# EAGLE schematic LED Cube 5x5x5 (EAGLE 8.3.1)
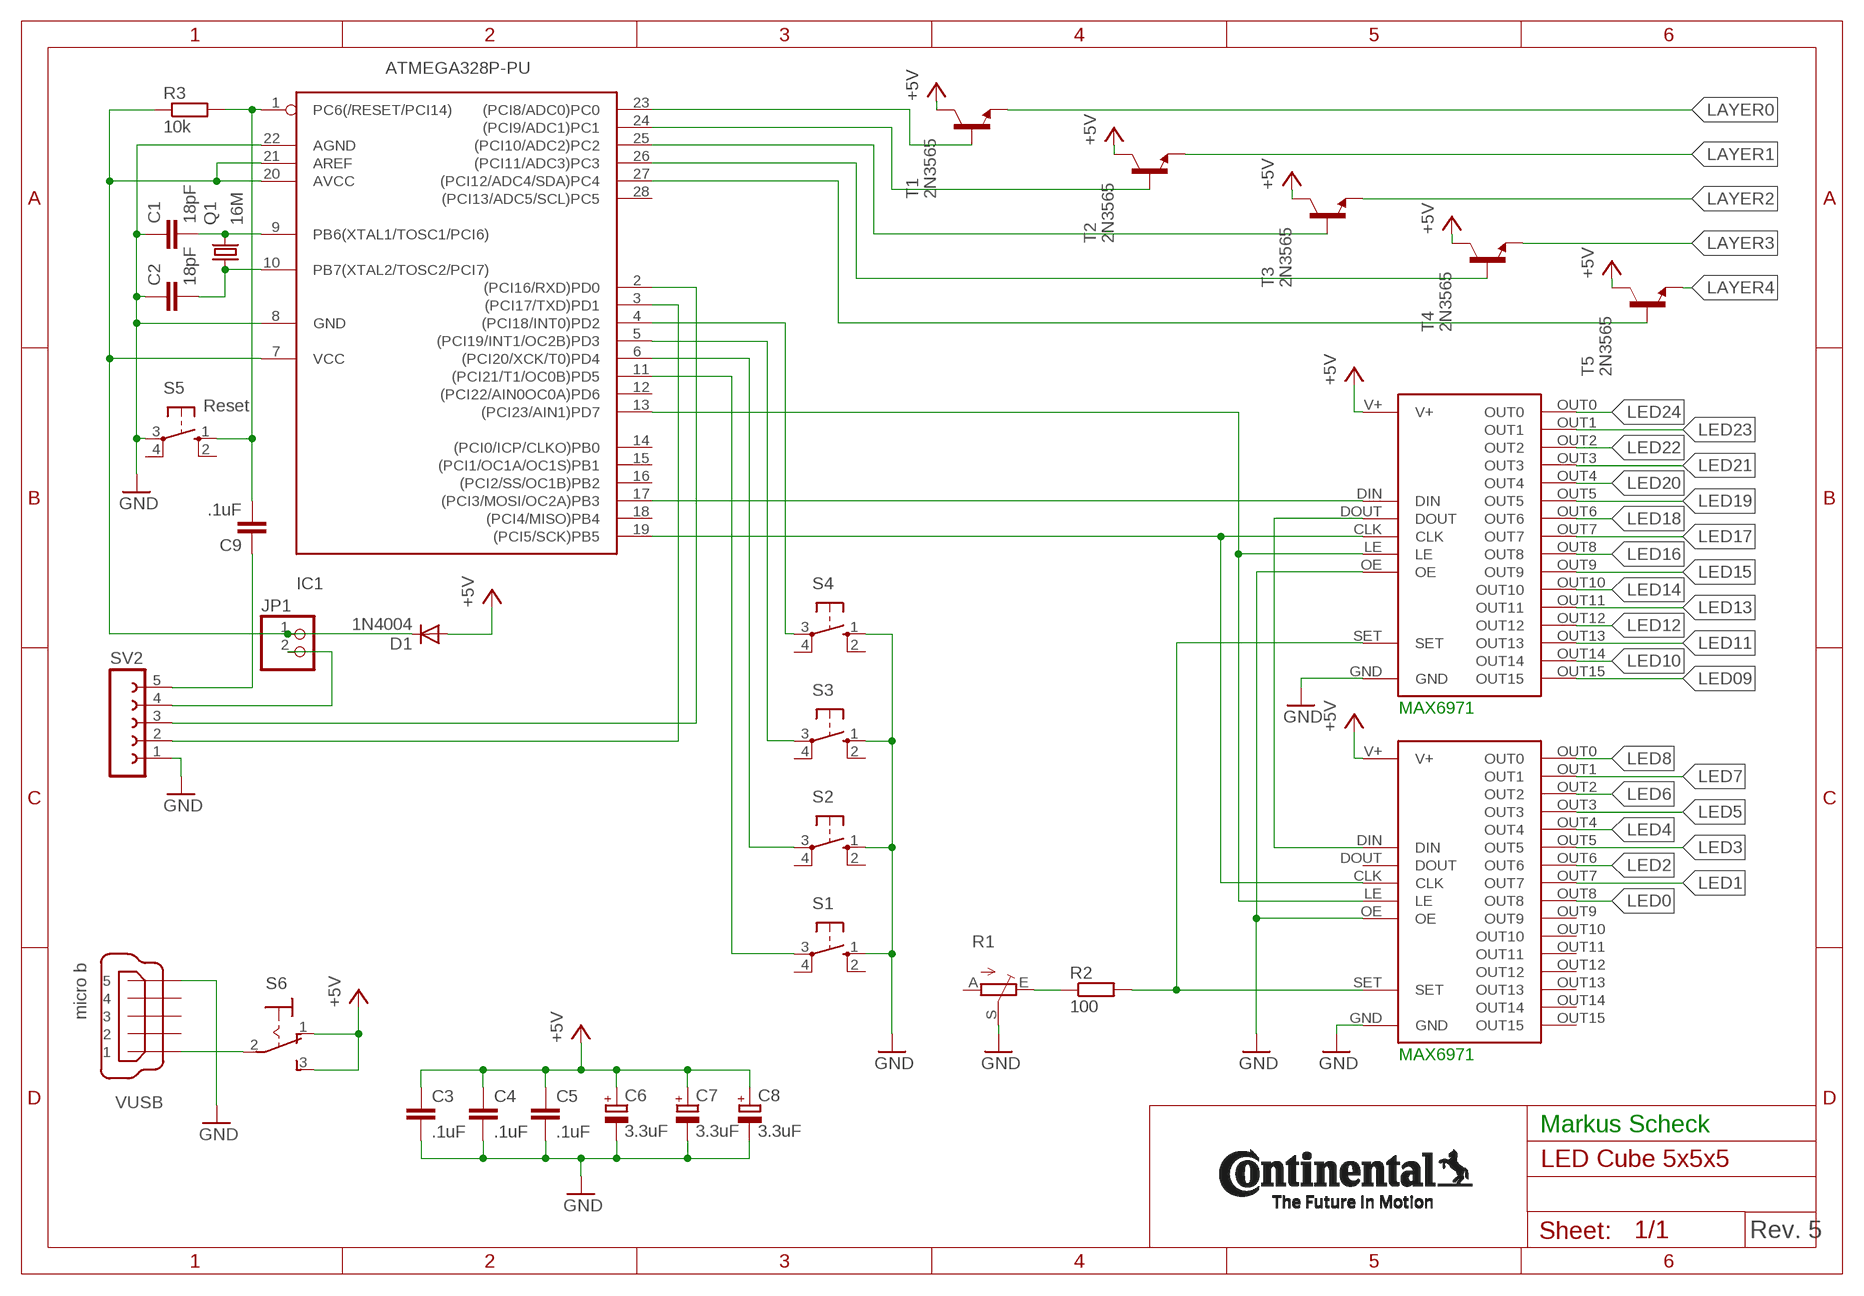
[diagram p0: schematic, sheet 1]

## Parts
C1  18pF  C2,5-3  [C2.5-3]
C2  18pF  C2,5-3  [C2.5-3]
C3  .1uF  C2,5-3  [C2.5-3]
C4  .1uF  C2,5-3  [C2.5-3]
C5  .1uF  C2,5-3  [C2.5-3]
C6  3.3uF  CPOL-EUB45181A  [B45181A]
C7  3.3uF  CPOL-EUB45181A  [B45181A]
C8  3.3uF  CPOL-EUB45181A  [B45181A]
C9  .1uF  C2.5/2  [C2.5-2]
D1  1N4004  [DO41-10]
IC1  ATMEGA328P-PU  ATMEGA328V-10P  [DIL28-3]
JP1  PINHD-1X2  [1X02]
Q1  16M  KX-KS  [11.4X4.5]
R1  TRIM_EU-CA6V  [CA6V]
R2  100  R-EU_0204/7  [0204/7]
R3  10k  R0204/7  [0204/7]
S1  10-XX  [B3F-10XX]
S2  10-XX  [B3F-10XX]
S3  10-XX  [B3F-10XX]
S4  10-XX  [B3F-10XX]
S5  Reset  10-XX  [B3F-10XX]
S6  320-916  [320-916]
SV2  FE05-1  [FE05-1]
T1  2N3565  [TO92]
T2  2N3565  [TO92]
T3  2N3565  [TO92]
T4  2N3565  [TO92]
T5  2N3565  [TO92]
U$1  MAX6971  [MAX6971]
U$2  MAX6971  [MAX6971]
VUSB  micro b  MINI-USB-32005-201  [32005-201]

## Nets
GND: C1.1 C2.1 C3.2 C4.2 C5.2 C6.- C7.- C8.- IC1.8(GND) IC1.22(AGND) R1.S S1.1(S) S2.1(S) S3.1(S) S4.1(S) S5.3(P) SV2.1 U$1.GND U$1.OE U$2.GND U$2.OE VUSB.5
LAYER0: T1.3(E)
LAYER1: T2.3(E)
LAYER2: T3.3(E)
LAYER3: T4.3(E)
LAYER4: T5.3(E)
LED0: U$1.OUT8
LED1: U$1.OUT7
LED2: U$1.OUT6
LED3: U$1.OUT5
LED4: U$1.OUT4
LED5: U$1.OUT3
LED6: U$1.OUT2
LED7: U$1.OUT1
LED8: U$1.OUT0
LED09: U$2.OUT15
LED10: U$2.OUT14
LED11: U$2.OUT13
LED12: U$2.OUT12
LED13: U$2.OUT11
LED14: U$2.OUT10
LED15: U$2.OUT9
LED16: U$2.OUT8
LED17: U$2.OUT7
LED18: U$2.OUT6
LED19: U$2.OUT5
LED20: U$2.OUT4
LED21: U$2.OUT3
LED22: U$2.OUT2
LED23: U$2.OUT1
LED24: U$2.OUT0
N$1: IC1.19((PCI5/SCK)PB5) U$1.CLK U$2.CLK
N$2: U$1.DIN U$2.DOUT
N$3: IC1.17((PCI3/MOSI/OC2A)PB3) U$2.DIN
N$4: IC1.13((PCI23/AIN1)PD7) U$1.LE U$2.LE
N$5: R1.E R2.1
N$7: R2.2 U$1.SET U$2.SET
N$9: IC1.6((PCI20/XCK/T0)PD4) S2.3(P)
N$10: IC1.11((PCI21/T1/OC0B)PD5) S1.3(P)
N$11: IC1.5((PCI19/INT1/OC2B)PD3) S3.3(P)
N$12: IC1.4((PCI18/INT0)PD2) S4.3(P)
N$13: C2.2 IC1.10(PB7(XTAL2/TOSC2/PCI7)) Q1.1
N$14: C1.2 IC1.9(PB6(XTAL1/TOSC1/PCI6)) Q1.2
N$15: IC1.3((PCI17/TXD)PD1) SV2.2
N$16: C9.2 IC1.1(PC6(/RESET/PCI14)) R3.2 S5.1(S)
N$17: IC1.2((PCI16/RXD)PD0) SV2.3
N$18: D1.C IC1.7(VCC) IC1.20(AVCC) IC1.21(AREF) JP1.1 R3.1
N$19: IC1.23((PCI8/ADC0)PC0) T1.2(B)
N$20: S6.2(P) VUSB.1
N$21: IC1.25((PCI10/ADC2)PC2) T3.2(B)
N$22: IC1.26((PCI11/ADC3)PC3) T4.2(B)
N$23: IC1.27((PCI12/ADC4/SDA)PC4) T5.2(B)
N$24: JP1.2 SV2.4
N$25: C9.1 SV2.5
N$29: IC1.24((PCI9/ADC1)PC1) T2.2(B)
VCC: C3.1 C4.1 C5.1 C6.+ C7.+ C8.+ D1.A S6.1(O) S6.3(S) T1.1(C) T2.1(C) T3.1(C) T4.1(C) T5.1(C) U$1.V+ U$2.V+ ; supply symbol labelled +5V
Unconnected: IC1.12((PCI22/AIN0OC0A)PD6) IC1.14((PCI0/ICP/CLKO)PB0) IC1.15((PCI1/OC1A/OC1S)PB1) IC1.16((PCI2/SS/OC1B)PB2) IC1.18((PCI4/MISO)PB4) IC1.28((PCI13/ADC5/SCL)PC5) R1.A S1.2(S1) S1.4(P1) S2.2(S1) S2.4(P1) S3.2(S1) S3.4(P1) S4.2(S1) S4.4(P1) S5.2(S1) S5.4(P1) U$1.DOUT U$1.OUT9 U$1.OUT10 U$1.OUT11 U$1.OUT12 U$1.OUT13 U$1.OUT14 U$1.OUT15 VUSB.2 VUSB.3 VUSB.4

## Notes on the sheet
- MAX6971
- MAX6971
- Markus Scheck
- Rev. 5
- C:/Users/uidn5332/Desktop/LED Cube/continental_logo_tagline_black_srgb_png-data.bmp

## Library data of the parts
C1-C5 C9 = capacitor-wima:C: CAPACITOR naming: grid - package width
C6-C8 = resistor:CPOL-EU: POLARIZED CAPACITOR, European symbol
D1 = diode:1N4004: DIODE general purpose rectifier, 1 A
IC1 = atmega328:ATMEGA328*P: MICROCONTROLLER 32 kBytes FLASH 2 kBytes SRAM 1 kBytes EEPROM USART 8-channel 10 bit ADC
JP1 = pinhead:PINHD-1X2: PIN HEADER
Q1 = crystal-geyer_V1_0:KX: Quartz Crystals (MHz) SMD: KX - Serie Model Size l/w/h [mm] Frequency Range Frequency Stability Temp. Range [°C] Load Capacitance AECQ 200 availabel Datasheet KX-4 KX-5 KX-6 KX-7 KX-9A KX-9B KX-12A KX-12B KX-13 KX-20 KX-K KX-KS 1.6/1.2/0.3 2.0/1.6/0.45 2.5/2.0/0.55 3.2/2.5/0.8 5.0/3.2/1.0 5.0/3.2/1.1 6.0/3.5/1.1 6.0/3.5/1.0 7.0/5.0 /1.3 11.6/5.5/1.6 12.3/4.5/4.2 12.3/4.5/3.2 24.0 ~ 80.0 MHz 16.0 ~ 80.0 MHz 12.0 ~ 80.0 MHz 8.0 ~ 60.0 MHz 7,68 ~ 300,0 MHz 8,0 ~ 50,0 MHz 8,0 ~ 150,0 MHz 8,0 ~ 50,0 MHz 6,0 ~ 160,0 MHz 3,579 ~ 25,0 MHz 3,579 ~ 70,0 MHz 3,579 ~ 70,0 MHz ±10 … ±50ppm ±10 … ±50ppm ±10 … ±50ppm ±10 … ±50ppm ±10 … ±50ppm ±10 … ±50ppm ±10 … ±50ppm ±10 … ±50ppm ±10 … ±50ppm ±50ppm ±10 … ±50ppm ±10 … ±50ppm (*) -40°C …+85°C (*) -40°C …+125°C (*) -40°C …+125°C (*) -40°C …+125°C (*) -40°C …+105°C (*) -40°C …+105°C (*) -40°C …+125°C (*) -40°C …+105°C (*) -40°C …+105°C (*) -40°C …+105°C (*) -40°C …+85°C (*) -40°C …+85°C 8, 8…16 8, 8…16 10, 8…16 12, 7…20 16, 10…20 16, 10…20 16, 10…20 16, 12…20 16, 12…20 16, 12…20 16, 12…30 16, 12…30 - yes yes yes - - - - - - - - KX-4.pdf <http://www.geyer-electronic.de/uploads/tx_userartikelfrequenz/GEYER-KX-4.pdf> KX-5.pdf <http://www.geyer-electronic.de/uploads/tx_userartikelfrequenz/GEYER-KX-5.pdf> KX-6.pdf <http://www.geyer-electronic.de/uploads/tx_userartikelfrequenz/GEYER-KX-6.pdf> KX-7.pdf <http://www.geyer-electronic.de/uploads/tx_userartikelfrequenz/GEYER-KX-7.pdf> KX-9A.pdf <http://www.geyer-electronic.de/uploads/tx_userartikelfrequenz/GEYER-KX-9A.pdf> KX-9B.pdf <http://www.geyer-electronic.de/uploads/tx_userartikelfrequenz/GEYER-KX-9B.pdf> KX-12A.pdf <http://www.geyer-electronic.de/uploads/tx_userartikelfrequenz/GEYER-KX-12A.pdf> KX-12B.pdf <http://www.geyer-electronic.de/uploads/tx_userartikelfrequenz/GEYER-KX-12B.pdf> KX-13.pdf <http://www.geyer-electronic.de/uploads/tx_userartikelfrequenz/GEYER-KX-13.pdf> KX-20.pdf <http://www.geyer-electronic.de/uploads/tx_userartikelfrequenz/GEYER-KX-20.pdf> KX-K.pdf <http://www.geyer-electronic.de/uploads/tx_userartikelfrequenz/GEYER-KX-K.pdf> KX-KS.pdf <http://www.geyer-electronic.de/uploads/tx_userartikelfrequenz/GEYER-KX-KS.pdf> <http://www.geyer-electronic.de/fileadmin/template/img/logo-geyer-electronic.png> Details see: http://www.geyer-electronic.de/Frequenz-Produkte.9.0.html Created 2016-06-07, Hans Locher 2016 (C) Geyer Quartz Technology KX4,KX5,KX6,KX7,KX9A,KX9B,KX12A,KX12B,KX13,KX20,KXK,KXKS;1612;2016;2520;3225;5032;6035;7050;11655;12345;1,6x1,2;2,0x1,6;2,5x2,0;3,2x2,5;5,0x3,2;6,0x3,5;7,0x5,0;11,6x5,5;12,3x4,5;12,3x4,5;1.6x1.2;2.0x1.6;2.5x2.0;3.2x2.5;5.0x3.2;6.0x3.5;7.0x5.0;11.6x5.5;12.3x4.5;12.3x4.5;
R1 = pot:TRIM_EU-: POTENTIOMETER
R2 = rcl:R-EU_: RESISTOR, European symbol
R3 = eagle-ltspice:R: RESISTOR, European symbol; SPICEMODEL: NONE; SPICEPREFIX: R
S1-S5 = switch-omron:10-XX: OMRON SWITCH; MPN: B3F-1000; OC_FARNELL: 176432; OC_NEWARK: 36M3542
S6 = switch:320-916: TOGGLE SWITCH distributor RS Components
SV2 = con-lsta:FE05-1: FEMALE HEADER; OC_FARNELL: unknown; OC_NEWARK: unknown
T1-T5 = transistor:2N3565: NPN TRANSISTOR
U$1 U$2 = MAX69XX:MAX6971
VUSB = con-cypressindustries:MINI-USB-: MINI USB-B Conector Source: www.cypressindustries.com; OC_FARNELL: unknown; OC_NEWARK: unknown